# Altium schematic sheet Mainboard_V1.0.SchDoc: Mainboard
size A4; PageSetup: Record=PageOptions|CenterHorizontal=True|CenterVertical=True|PrintScale=0.97|XCorrection=1.00|YCorrection=1.00|PrintKind=0|BorderSize=5000000|LeftOffset=0|BottomOffset=0|Orientation=2|PaperLength=1000|PaperWidth=1000|Scale=100|PaperSource=7|PrintQuality=-3|MediaType=1|DitherType=10|PrintScaleMode=1|PaperKind=A4|PaperIndex=9; Organization: Ostschweizer Fachhochschule; Address2: Florian Baumgartner & Alain Keller; Address3: florian.baumgartner@ost.ch; DocumentNumber: 1; Revision: V1.0; SheetNumber: 1; SheetTotal: 7; Author: Florian Baumgartner & Alain Keller; Subtitle: Overview
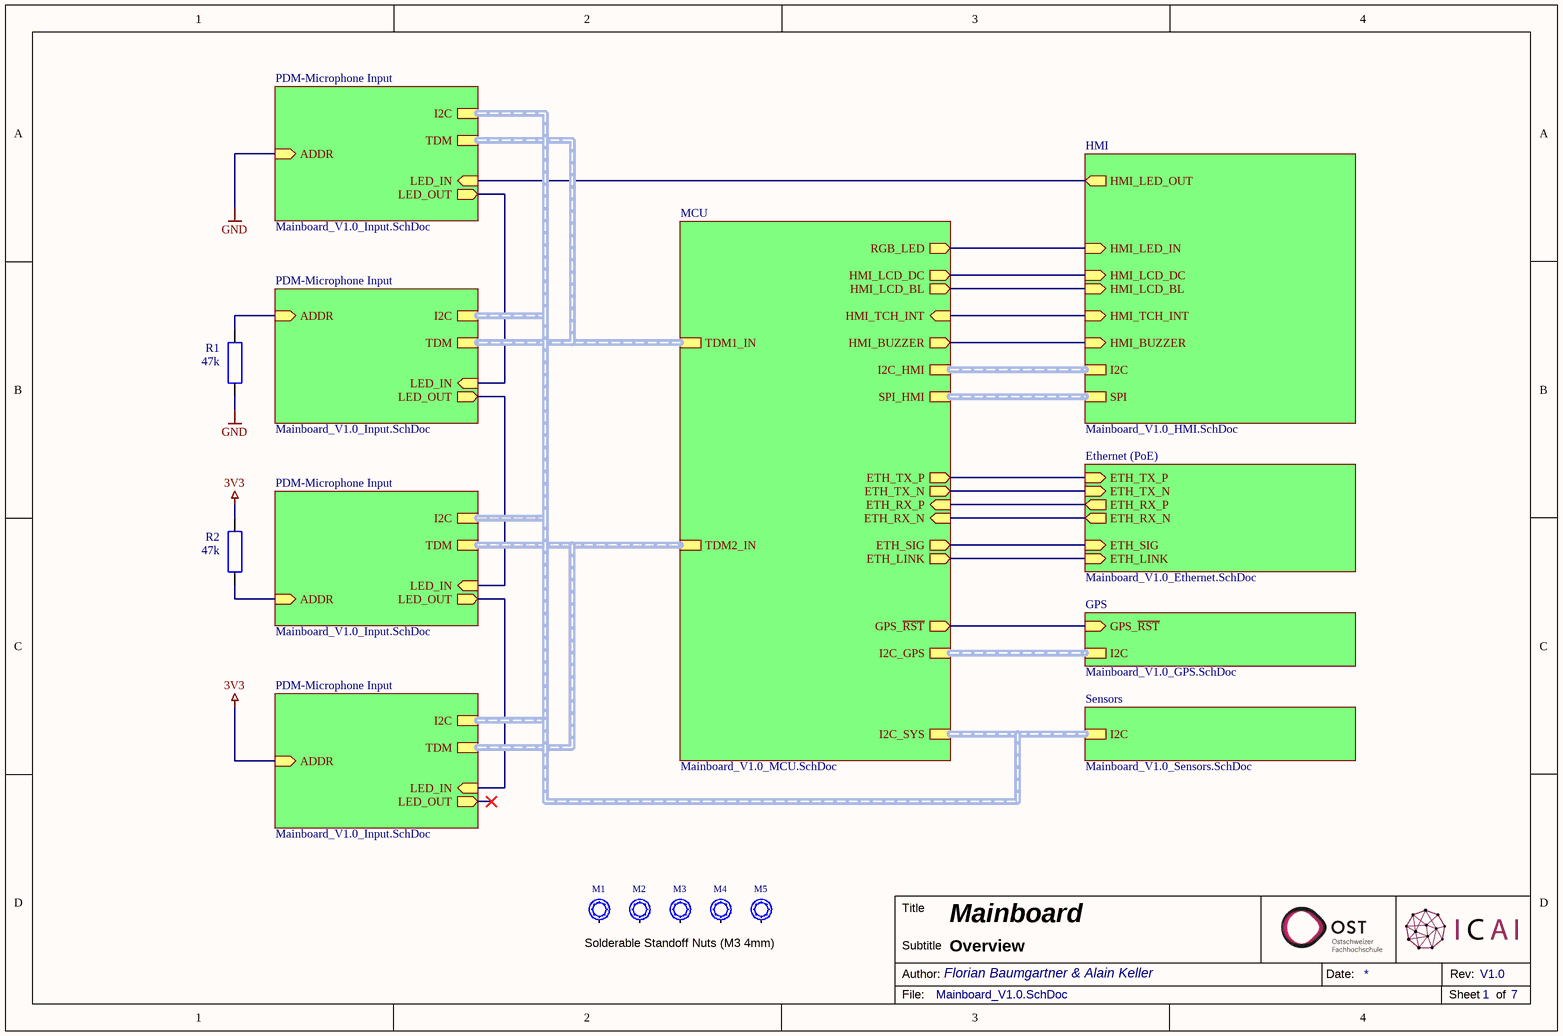
[diagram p0: Mainboard_V1.0.SchDoc]

## Parts
M1  SMTSO-M3-3ET  [SMD Solder-Nut (M3 4mm)]  (value not drawn)
M2  SMTSO-M3-3ET  [SMD Solder-Nut (M3 4mm)]  (value not drawn)
M3  SMTSO-M3-3ET  [SMD Solder-Nut (M3 4mm)]  (value not drawn)
M4  SMTSO-M3-3ET  [SMD Solder-Nut (M3 4mm)]  (value not drawn)
M5  SMTSO-M3-3ET  [SMD Solder-Nut (M3 4mm)]  (value not drawn)
R1  47k  [SMD Widerstand 0603]
R2  47k  [SMD Widerstand 0603]

## Sub-sheets
Ethernet (PoE) = Mainboard_V1.0_Ethernet.SchDoc: ETH_SIG (in), ETH_TX_P (in), ETH_RX_N (out), ETH_LINK (in), ETH_TX_N (in), ETH_RX_P (out)
GPS = Mainboard_V1.0_GPS.SchDoc: GPS_~{RST} (in), I2C (harness I2C)
HMI = Mainboard_V1.0_HMI.SchDoc: HMI_LCD_DC (in), HMI_TCH_INT (in), HMI_LED_IN (in), HMI_BUZZER (in), HMI_LCD_BL (in), HMI_LED_OUT (out), SPI (harness SPI), I2C (harness I2C)
MCU = Mainboard_V1.0_MCU.SchDoc: I2C_SYS (harness I2C_SYS), RGB_LED (out), I2C_HMI (harness I2C_HMI), SPI_HMI (harness SPI), TDM1_IN (harness TDM1_IN), TDM2_IN (harness TDM2_IN), GPS_~{RST} (out), HMI_BUZZER (out), ETH_TX_N (out), ETH_LINK (out), ETH_SIG (out), HMI_LCD_BL (out), ETH_TX_P (out), HMI_LCD_DC (out), ETH_RX_P (in), ETH_RX_N (in), HMI_TCH_INT (in), I2C_GPS (harness I2C_SYS)
PDM-Microphone Input = Mainboard_V1.0_Input.SchDoc: I2C (harness I2C), LED_IN (in), TDM (harness TDM), LED_OUT (out), ADDR (in)
PDM-Microphone Input = Mainboard_V1.0_Input.SchDoc: I2C (harness I2C), LED_IN (in), TDM (harness TDM), LED_OUT (out), ADDR (in)
PDM-Microphone Input = Mainboard_V1.0_Input.SchDoc: I2C (harness I2C), LED_IN (in), TDM (harness TDM), LED_OUT (out), ADDR (in)
PDM-Microphone Input = Mainboard_V1.0_Input.SchDoc: I2C (harness I2C), LED_IN (in), TDM (harness TDM), LED_OUT (out), ADDR (in)
Sensors = Mainboard_V1.0_Sensors.SchDoc: I2C (harness I2C)

## Nets
3V3: R2.2 ; sheet PDM-Microphone Input/ADDR
GND: R1.1 ; sheet PDM-Microphone Input/ADDR
NetR1_2: R1.2 ; sheet PDM-Microphone Input/ADDR
NetR2_1: R2.1 ; sheet PDM-Microphone Input/ADDR
(unnamed): sheet PDM-Microphone Input/LED_IN, sheet PDM-Microphone Input/LED_OUT
(unnamed): sheet PDM-Microphone Input/LED_IN, sheet PDM-Microphone Input/LED_OUT
(unnamed): sheet PDM-Microphone Input/LED_IN, sheet PDM-Microphone Input/LED_OUT
(unnamed): sheet PDM-Microphone Input/LED_IN, sheet HMI/HMI_LED_OUT
(unnamed): sheet HMI/HMI_LCD_DC, sheet MCU/HMI_LCD_DC
(unnamed): sheet HMI/HMI_TCH_INT, sheet MCU/HMI_TCH_INT
(unnamed): sheet HMI/HMI_LED_IN, sheet MCU/RGB_LED
(unnamed): sheet HMI/HMI_BUZZER, sheet MCU/HMI_BUZZER
(unnamed): sheet HMI/HMI_LCD_BL, sheet MCU/HMI_LCD_BL
(unnamed): sheet MCU/GPS_~{RST}, sheet GPS/GPS_~{RST}
(unnamed): sheet MCU/ETH_TX_N, sheet Ethernet (PoE)/ETH_TX_N
(unnamed): sheet MCU/ETH_LINK, sheet Ethernet (PoE)/ETH_LINK
(unnamed): sheet MCU/ETH_SIG, sheet Ethernet (PoE)/ETH_SIG
(unnamed): sheet MCU/ETH_TX_P, sheet Ethernet (PoE)/ETH_TX_P
(unnamed): sheet MCU/ETH_RX_P, sheet Ethernet (PoE)/ETH_RX_P
(unnamed): sheet MCU/ETH_RX_N, sheet Ethernet (PoE)/ETH_RX_N

Not connected (* = marked no-connect by the designer): M1 1; M2 1; M3 1; M4 1; M5 1

## Buses and harness runs
harness sheet GPS/I2C = sheet MCU/I2C_GPS
harness sheet HMI/I2C = sheet MCU/I2C_HMI
harness sheet HMI/SPI = sheet MCU/SPI_HMI
harness sheet MCU/I2C_SYS = sheet PDM-Microphone Input/I2C = sheet Sensors/I2C
harness sheet MCU/TDM1_IN = sheet PDM-Microphone Input/TDM
harness sheet MCU/TDM2_IN = sheet PDM-Microphone Input/TDM

## Notes on the sheet
- Solderable Standoff Nuts (M3 4mm)
- Title
- Author:
- Subtitle
- Date:
- Rev:
- File:
- Sheet
- of

## Library data of the parts
M1-M5 = M-Spacer_M3_3mm: Solderable Standoff Nut; Component Value: M3 4mm; Mouser: 153-SMTSO-M3-4ET; Component Description: Solderable Standoff Nut; Unit Price: 0.06; JLC-Parts: C2915635; ComponentLink1Description: Datasheet; ComponentLink1URL: https://datasheet.lcsc.com/lcsc/2111221230_Sinhoo-SMTSO3040CTJ_C2915635.pdf
R1 R2 = R-RESISTOR: RES (E=Heizwiderstand B=Messwandler); Component Description: Thick Film Chip Resistor; Component Value: 47k (75V, 100mW, 1%); Digikey: P47.0KHCT-ND; Farnell: 2303213; Mouser: 667-ERJ-3EKF4702V; JLC-Parts: C25819; Unit Price: 0.01